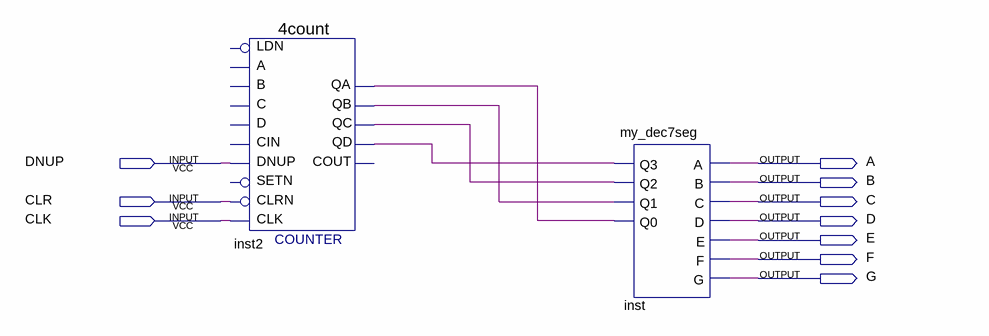
[diagram p0: schematic sheet]
// Quartus schematic contador_display.bdf as structural Verilog: 2 symbols, 10 pins
module contador_display (
  input  DNUP,
  input  CLR,
  input  CLK,
  output A,
  output B,
  output C,
  output D,
  output E,
  output F,
  output G
);

  wire inst2_qa, inst2_qb, inst2_qc, inst2_qd;

  \4count  inst2 (
    .DNUP(DNUP), .CLK(CLK), .CLRN(CLR), .QA(inst2_qa), .QB(inst2_qb), .QC(inst2_qc), .QD(inst2_qd));  // open: LDN, B, A, D, CIN, SETN, C, COUT
  my_dec7seg inst (
    .Q3(inst2_qd), .Q2(inst2_qc), .Q1(inst2_qb), .Q0(inst2_qa), .A(A), .B(B), .C(C), .D(D), .E(E), .F(F),
    .G(G));
endmodule
